# Altium schematic sheet Принц. схема - чертеж.SchDoc
size 594 x 420 mm; PageSetup: Record=PageOptions|CenterHorizontal=True|CenterVertical=True|PrintScale=1.00|XCorrection=1.00|YCorrection=1.00|PrintKind=0|BorderSize=5000000|LeftOffset=0|BottomOffset=0|Orientation=2|PaperLength=1000|PaperWidth=1000|Scale=100|PaperSource=15|PrintQuality=1200|MediaType=1|DitherType=10|PrintScaleMode=0|PaperKind=A2|PaperIndex=66
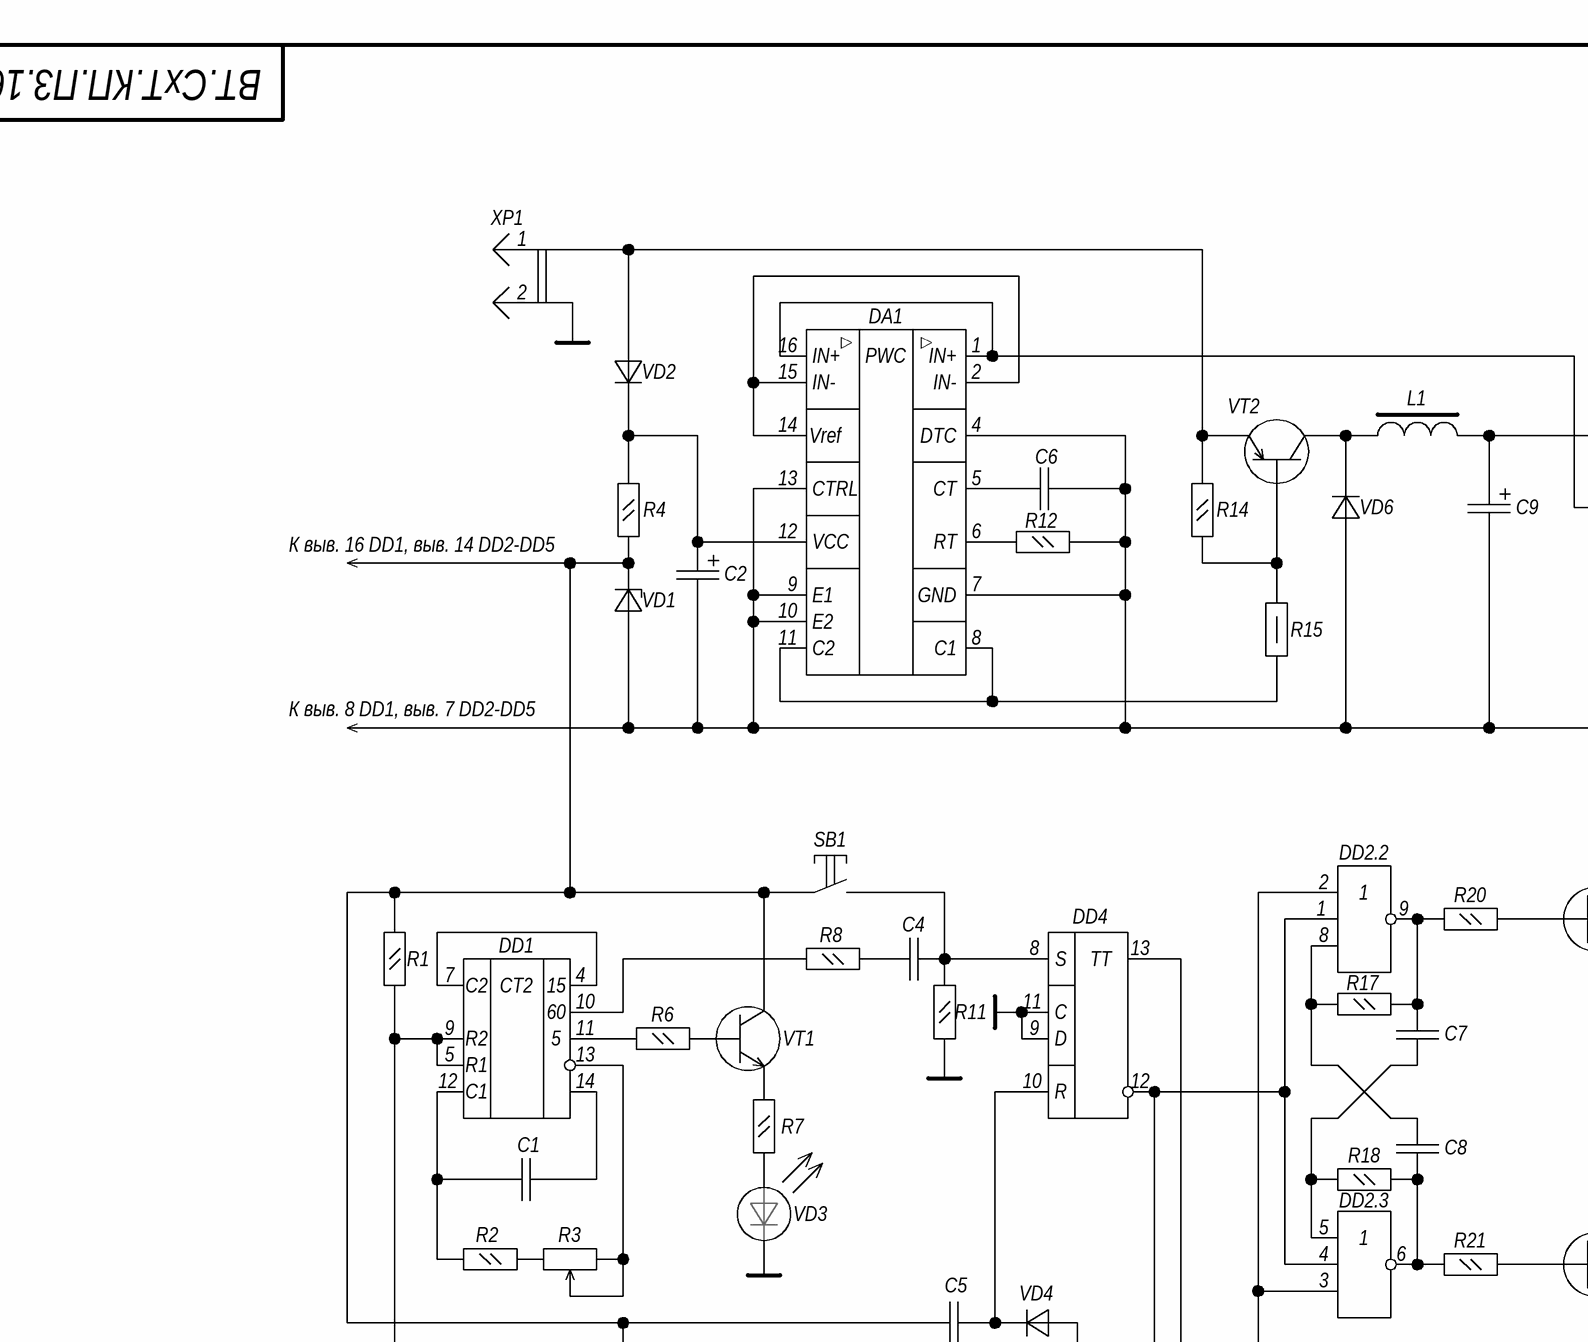
[diagram p0: Принц. схема - чертеж.SchDoc, top left]
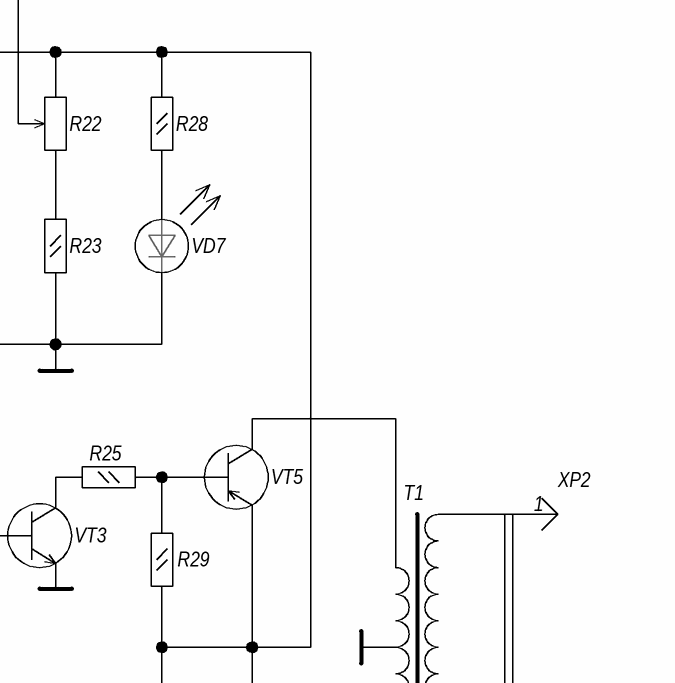
[diagram p1: Принц. схема - чертеж.SchDoc, top right]
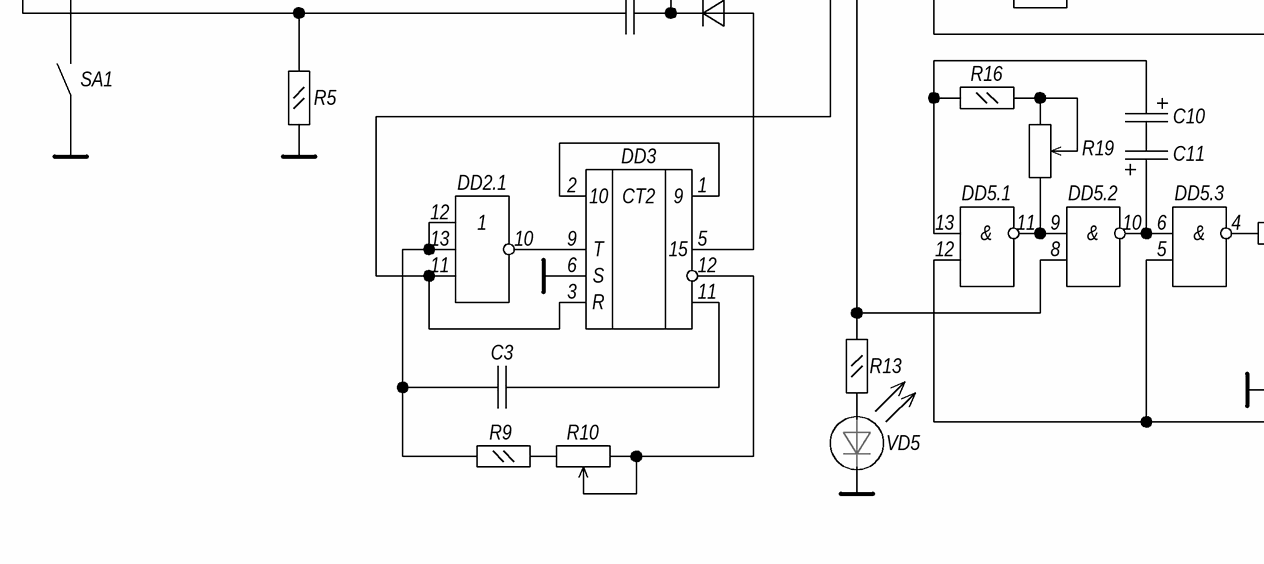
[diagram p2: Принц. схема - чертеж.SchDoc, bottom left]
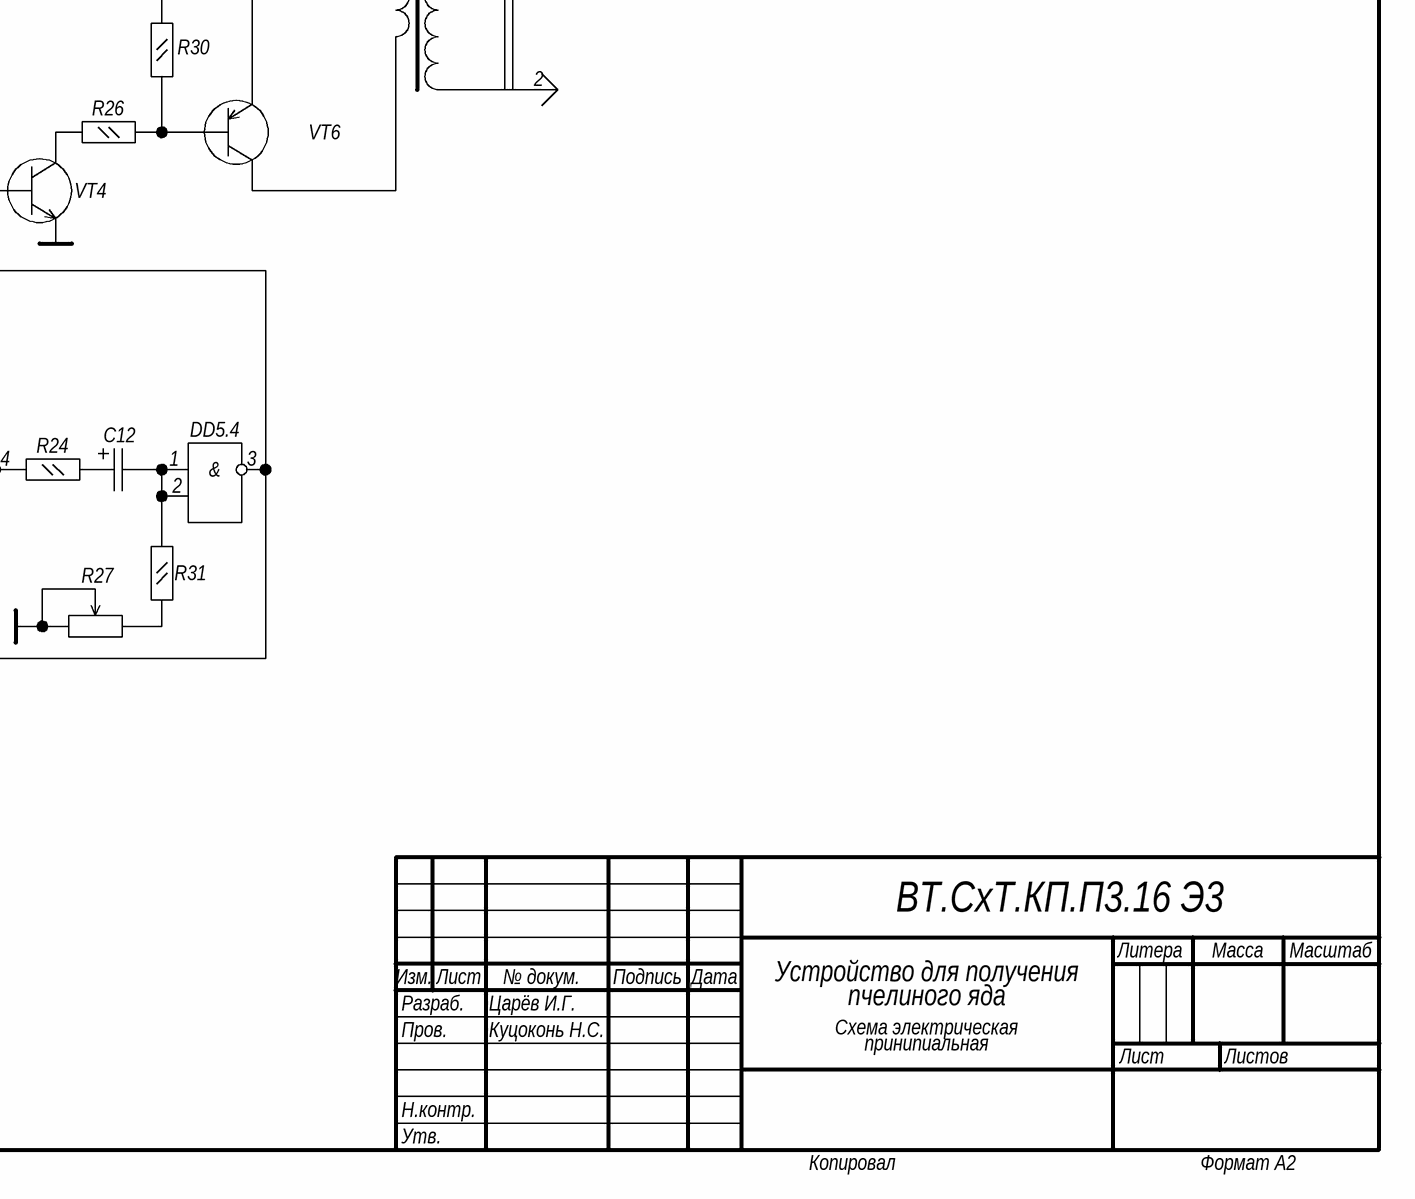
[diagram p3: Принц. схема - чертеж.SchDoc, bottom right]

## Notes on the sheet
- ВТ.СхТ.КП.П3.16 Э3
- XP1
- 1
- 2
- DA1
- VD2
- 16
- 15
- IN+
- IN-
- PWC
- 14
- Vref
- DTC
- 4
- C6
- VT2
- L1
- R4
- 13
- CTRL
- CT
- 5
- R12
- R14
- VD6
- C9
- R22
- R28
- К выв. 16 DD1, выв. 14 DD2-DD5
- C2
- 12
- 9
- VCC
- E1
- GND
- RT
- 7
- 6
- VD1
- 10
- 11
- E2
- C1
- 8
- R15
- R23
- VD7
- К выв. 8 DD1, выв. 7 DD2-DD5
- SB1
- DD2.2
- R25
- VT5
- XP2
- C4
- DD4
- R20
- VT3
- T1
- R1
- CT2
- DD1
- R8
- S
- TT
- R17
- R29
- R2
- 60
- R6
- VT1
- R11
- C
- D
- C7
- R7
- R
- R30
- DD2.3
- R18
- C8
- R26
- R3
- VD3
- R21
- VT4
- VT6
- C5
- VD4
- 3
- SA1
- R16
- R5
- DD3
- R19
- C10
- C11
- DD2.1
- DD5.1
- DD5.2
- DD5.3
- R24
- C12
- DD5.4
- T
- &
- C3
- R13
- R27
- R31
- R9
- R10
- VD5
- Разраб.
- Изм.
- Лист
- Царёв И.Г.
- № докум.
- Подпись
- Дата
- Устройство для получения
- пчелиного яда
- Литера
- Масса
- Масштаб
- Пров.
- Куцоконь Н.С.
- Схема электрическая
- принипиальная
- Листов
- Н.контр.
- Утв.
- Копировал
- Формат А2